# EAGLE design piboy (EAGLE 8.4.1)
COMPANY: ADAFRUIT INDUSTRIES; DRAWN: KTOWN; REV: A
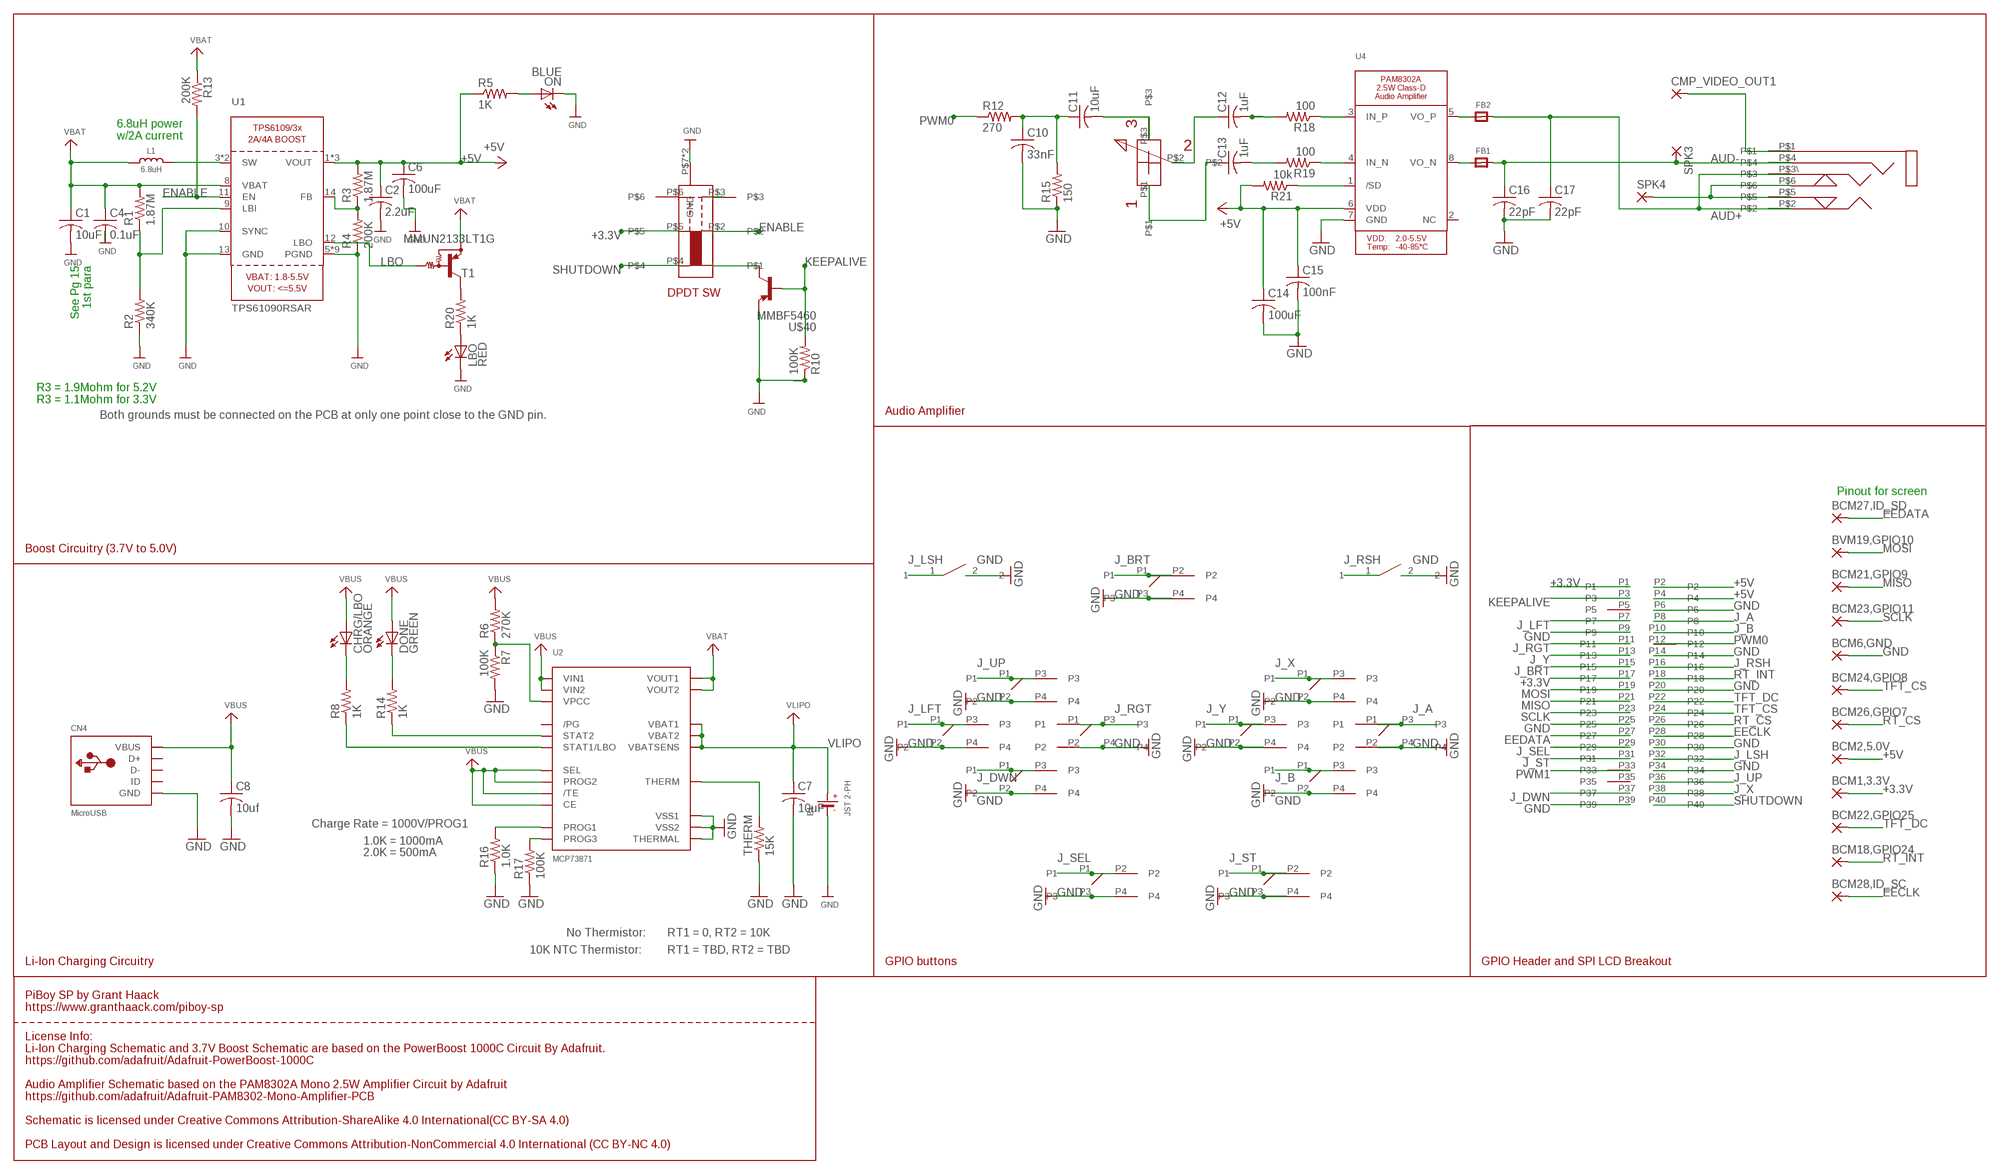
[diagram p0: schematic, sheet 1]

## Parts
B1  JST 2-PH  MICROBUILDER_BATTERYPH2_NOTHERMALS  [MICROBUILDER_JSTPH2_NOTHERMALS]
BCM1,3.3V  WIREPAD_1,6/0,9  [WIREPAD_1,6/0,9]
BCM2,5.0V  WIREPAD_1,6/0,9  [WIREPAD_1,6/0,9]
BCM6,GND  WIREPAD_1,6/0,9  [WIREPAD_1,6/0,9]
BCM18,GPIO24  WIREPAD_1,6/0,9  [WIREPAD_1,6/0,9]
BCM21,GPIO9  WIREPAD_1,6/0,9  [WIREPAD_1,6/0,9]
BCM22,GPIO25  WIREPAD_1,6/0,9  [WIREPAD_1,6/0,9]
BCM23,GPIO11  WIREPAD_1,6/0,9  [WIREPAD_1,6/0,9]
BCM24,GPIO8  WIREPAD_1,6/0,9  [WIREPAD_1,6/0,9]
BCM26,GPIO7  WIREPAD_1,6/0,9  [WIREPAD_1,6/0,9]
BCM27,ID_SD  WIREPAD_1,6/0,9  [WIREPAD_1,6/0,9]
BCM28,ID_SC  WIREPAD_1,6/0,9  [WIREPAD_1,6/0,9]
BVM19,GPIO10  WIREPAD_1,6/0,9  [WIREPAD_1,6/0,9]
C1  10uF  C-USC1210  [C1210]
C2  2.2uF  C-USC0805  [C0805]
C4  0.1uF  C-USC0805  [C0805]
C6  100uF  C-USC1210  [C1210]
C7  10uF  C-USC1210  [C1210]
C8  10uf  C-USC0805  [C0805]
C10  33nF  C-USC0805  [C0805]
C11  10uF  C-USC1210  [C1210]
C12  1uF  C-USC0805  [C0805]
C13  1uF  C-USC0805  [C0805]
C14  100uF  C-USC1210  [C1210]
C15  100nF  C-USC0805  [C0805]
C16  22pF  C-USC0805  [C0805]
C17  22pF  C-USC0805  [C0805]
CHRG/LBO  ORANGE  ADAFRUIT_LEDCHIPLED_0603  [ADAFRUIT_CHIPLED_0603]
CMP_VIDEO_OUT1  WIREPAD_1,6/0,9  [WIREPAD_1,6/0,9]
CN4  MicroUSB  USBMICRO_20329  [4UCONN_20329]
DONE  GREEN  ADAFRUIT_LEDCHIPLED_0603  [ADAFRUIT_CHIPLED_0603]
FB1  FERRITE0805  [0805]
FB2  FERRITE0805  [0805]
L1  6.8uH  INDUCTORTDK_VLC5045  [INDUCTOR_5X5MM_TDK_VLC5045]
LBO  RED  ADAFRUIT_LEDCHIPLED_0603  [ADAFRUIT_CHIPLED_0603]
ON  BLUE  ADAFRUIT_LEDCHIPLED_0603  [ADAFRUIT_CHIPLED_0603]
R1  1.87M  R-US_R0805  [R0805]
R2  340K  R-US_R0805  [R0805]
R3  1.87M  R-US_R0805  [R0805]
R4  200K  R-US_R0805  [R0805]
R5  1K  R-US_R0805  [R0805]
R6  270K  R-US_R0805  [R0805]
R7  100K  R-US_R0805  [R0805]
R8  1K  R-US_R0805  [R0805]
R10  100K  R-US_R0805  [R0805]
R12  270  R-US_R0805  [R0805]
R13  200K  R-US_R0805  [R0805]
R14  1K  R-US_R0805  [R0805]
R15  150  R-US_R0805  [R0805]
R16  1.0K  R-US_R0805  [R0805]
R17  100K  R-US_R0805  [R0805]
R18  100  R-US_R0805  [R0805]
R19  100  R-US_R0805  [R0805]
R20  1K  R-US_R0805  [R0805]
R21  10k  R-US_R0805  [R0805]
SPK3  WIREPAD_1,6/0,9  [WIREPAD_1,6/0,9]
SPK4  WIREPAD_1,6/0,9  [WIREPAD_1,6/0,9]
T1  MMUN2133LT1G  TRANSISTOR_MUN2113T1-PNP_DRIVER-SC59-BEC  [TRANSISTOR_SC59-BEC]
THERM  15K  R-US_R0805  [R0805]
U1  TPS61090RSAR  VREG_TPS6103X  [PVQFN-16]
U2  MCP73871  [QFN20_4MM]
U4  AUDIOAMP_PAM8302A  [MSOP8_0.65MM]
U$9  961240-6300-AR-PR  [961240-6300-AR-PR]
U$10  PIBOY_SKRRAAE010  [PIBOY_SKRRAAE010]
U$11  PIBOY_SKRRAAE010  [PIBOY_SKRRAAE010]
U$12  PIBOY_SKRRAAE010  [PIBOY_SKRRAAE010]
U$13  PIBOY_SKRRAAE010  [PIBOY_SKRRAAE010]
U$15  PIBOY_SKRRAAE010  [PIBOY_SKRRAAE010]
U$16  PIBOY_SKRRAAE010  [PIBOY_SKRRAAE010]
U$17  PIBOY_SKRRAAE010  [PIBOY_SKRRAAE010]
U$18  PIBOY_SKRRAAE010  [PIBOY_SKRRAAE010]
U$21  PIBOY_TL3315NF100Q  [PIBOY_TL3315NF100Q]
U$22  PIBOY_TL3315NF100Q  [PIBOY_TL3315NF100Q]
U$25  PIBOY_TL3315NF100Q  [PIBOY_TL3315NF100Q]
U$26  SWITCH_TL1105L-4,3  [SWITCH_TL1105L-4,3]
U$28  SWITCH_TL1105L-4,3  [SWITCH_TL1105L-4,3]
U$29  RK10J12R0A0B  [RK10J12R0A0B]
U$30  SJ-43504-SMT-TR  [SJ-43504-SMT-TR]
U$31  EG2210-SW  [EG2210-SW]
U$40  MMBF5460  [SOT23]

## Nets
+3.3V: BCM1,3.3V.1(P) U$9.P1 U$9.P17 U$31.P$5
+5V: BCM2,5.0V.1(P) C2.1 C6.1 C14.1 C15.1 R3.2 R5.1 R21.2 U1.1(VOUT) U1.15(VOUT) U1.16(VOUT) U4.6(VDD) U$9.P2 U$9.P4
AUD+: C17.1 FB2.2 U$30.P$2 U$30.P$3\
AUD+_HDPN_OUT: SPK4.1(P) U$30.P$5 U$30.P$6
AUD-: C16.1 FB1.2 SPK3.1(P) U$30.P$4
CMP_VIDEO_OUT1: CMP_VIDEO_OUT1.1(P) U$30.P$1
EECLK: BCM28,ID_SC.1(P) U$9.P28
EEDATA: BCM27,ID_SD.1(P) U$9.P27
ENABLE: R13.2 U1.11(EN) U$31.P$2
GND: B1.1(-) B1.NC1(-) B1.NC2(-) BCM6,GND.1(P) C1.2 C2.2 C4.2 C6.2 C7.2 C8.2 C10.2 C14.2 C15.2 C16.2 C17.2 CN4.BASE@1(GND) CN4.BASE@2(GND) CN4.GND CN4.SPRT@1(GND) CN4.SPRT@2(GND) CN4.SPRT@3(GND) CN4.SPRT@4(GND) LBO.C ON.C R2.1 R4.1 R7.2 R10.1 R15.1 R16.1 R17.1 THERM.1 U1.5(PGND) U1.6(PGND) U1.7(PGND) U1.10(SYNC) U1.13(GND) U1.P$18(PGND) U1.P$19(PGND) U1.P$20(PGND) U1.P$21(PGND) U1.P$22(PGND) U1.THERMAL(PGND) U2.P$10(VSS1) U2.P$11(VSS2) U2.P$21(THERMAL) U4.7(GND) U$9.P6 U$9.P9 U$9.P14 U$9.P20 U$9.P25 U$9.P30 U$9.P34 U$9.P39 U$10.P2 U$10.P4 U$11.P2 U$11.P4 U$12.P2 U$12.P4 U$13.P2 U$13.P4 U$15.P2 U$15.P4 U$16.P2 U$16.P4 U$17.P2 U$17.P4 U$18.P2 U$18.P4 U$21.P3 U$21.P4 U$22.P3 U$22.P4 U$25.P3 U$25.P4 U$26.2 U$28.2 U$31.P$7(GND) U$31.P$8(GND) U$40.2(S)
J_A: U$9.P8 U$17.P1 U$17.P3
J_B: U$9.P10 U$18.P1 U$18.P3
J_BRT: U$9.P15 U$25.P1 U$25.P2
J_DWN: U$9.P37 U$13.P1 U$13.P3
J_LFT: U$9.P7 U$11.P1 U$11.P3
J_LSH: U$9.P32 U$26.1
J_RGT: U$9.P11 U$12.P1 U$12.P3
J_RSH: U$9.P16 U$28.1
J_SEL: U$9.P29 U$21.P1 U$21.P2
J_ST: U$9.P31 U$22.P1 U$22.P2
J_UP: U$9.P36 U$10.P1 U$10.P3
J_X: U$9.P38 U$15.P1 U$15.P3
J_Y: U$9.P13 U$16.P1 U$16.P3
KEEPALIVE: R10.2 U$9.P3 U$40.3(G)
LBO: T1.B U1.12(LBO)
MISO: BCM21,GPIO9.1(P) U$9.P21
MOSI: BVM19,GPIO10.1(P) U$9.P19
N$1: L1.P$2 U1.3(SW) U1.4(SW)
N$2: LBO.A R20.1
N$3: R1.1 R2.2 U1.9(LBI)
N$4: ON.A R5.2
N$5: R3.1 R4.2 U1.14(FB)
N$6: R20.2 T1.C
N$7: R6.1 R7.1 U2.P$2(VPCC)
N$8: DONE.C R14.2
N$9: R14.1 U2.P$7(STAT2)
N$10: THERM.2 U2.P$5(THERM)
N$11: R8.1 U2.P$8(STAT1/LBO)
N$12: CHRG/LBO.C R8.2
N$13: R17.2 U2.P$12(PROG3)
N$16: R16.2 U2.P$13(PROG1)
N$18: C10.1 C11.1 R12.2 R15.2
N$20: U$31.P$3
N$21: U$31.P$1 U$40.1(D)
N$35: C11.2 U$29.P$3
N$37: C12.1 U$29.P$2
N$38: C13.1 U$29.P$1
N$39: C13.2 R19.2
N$40: C12.2 R18.2
N$41: R18.1 U4.3(IN_P)
N$42: R19.1 U4.4(IN_N)
N$45: R21.1 U4.1(/SD)
N$47: FB1.1 U4.8(VO_N)
N$48: FB2.1 U4.5(VO_P)
PWM0: R12.1 U$9.P12
PWM1: U$9.P33
RT_CS: BCM26,GPIO7.1(P) U$9.P26
RT_INT: BCM18,GPIO24.1(P) U$9.P18
SCLK: BCM23,GPIO11.1(P) U$9.P23
SHUTDOWN: U$9.P40 U$31.P$4
TFT_CS: BCM24,GPIO8.1(P) U$9.P24
TFT_DC: BCM22,GPIO25.1(P) U$9.P22
VBAT: C1.1 C4.1 L1.P$1 R1.2 R13.1 T1.E U1.8(VBAT) U2.P$1(VOUT1) U2.P$20(VOUT2)
VBUS: C8.1 CHRG/LBO.A CN4.VBUS DONE.A R6.2 U2.P$3(SEL) U2.P$4(PROG2) U2.P$9(/TE) U2.P$17(CE) U2.P$18(VIN1) U2.P$19(VIN2)
VLIPO: B1.2(+) C7.1 U2.P$14(VBAT1) U2.P$15(VBAT2) U2.P$16(VBATSENS)
Unconnected: CN4.D+ CN4.D- CN4.ID U2.P$6(/PG) U4.2(NC) U$9.P5 U$9.P35 U$31.P$6

## Notes on the sheet
- 6.8uH power
  w/2A current
- See Pg 15
  1st para
- R3 = 1.9Mohm for 5.2V
  R3 = 1.1Mohm for 3.3V
- Both grounds must be connected on the PCB at only one point close to the GND pin. | Audio Amplifier
- Pinout for screen
- Boost Circuitry (3.7V to 5.0V)
- Charge Rate = 1000V/PROG1
- 1.0K = 1000mA
- 2.0K = 500mA
- No Thermistor: | RT1 = 0, RT2 = 10K
- 10K NTC Thermistor: | RT1 = TBD, RT2 = TBD
- Li-Ion Charging Circuitry | GPIO buttons | GPIO Header and SPI LCD Breakout
- PiBoy SP by Grant Haack
  https://www.granthaack.com/piboy-sp
- License Info:
  Li-Ion Charging Schematic and 3.7V Boost Schematic are based on the PowerBoost 1000C Circuit By Adafruit.
  https://github.com/adafruit/Adafruit-PowerBoost-1000C
  
  Audio Amplifier Schematic based on the PAM8302A Mono 2.5W Amplifier Circuit by Adafruit
  https://github.com/adafruit/Adafruit-PAM8302-Mono-Amplifier-PCB
  
  Schematic is licensed under Creative Commons Attribution-ShareAlike 4.0 International(CC BY-SA 4.0)
  
  PCB Layout and Design is licensed under Creative Commons Attribution-NonCommercial 4.0 International (CC BY-NC 4.0)

## Library data of the parts
B1 = piboy_new:MICROBUILDER_BATTERY: CR1220 SMT - Digikey: 3001K-ND CD2032 BAT-HLD-001 - Digikey: BAT-HLD-001-ND
BCM1,3.3V BCM2,5.0V BCM6,GND BCM18,GPIO24 BCM21,GPIO9 BCM22,GPIO25 BCM23,GPIO11 BCM24,GPIO8 BCM26,GPIO7 BCM27,ID_SD BCM28,ID_SC BVM19,GPIO10 CMP_VIDEO_OUT1 SPK3 SPK4 = piboy_new:WIREPAD_1,6/0,9: THROUGH-HOLE PAD
C1 C6 C7 C10-C17 = resistor:C-US: CAPACITOR, American symbol
C2 C4 C8 = adafruit:C-US: CAPACITOR, American symbol
CHRG/LBO DONE LBO ON = piboy_new:ADAFRUIT_LED: LED OSRAM: - CHIPLED LG R971, LG N971, LY N971, LG Q971, LY Q971, LO R971, LY R971 LH N974, LH R974 LS Q976, LO Q976, LY Q976 LO Q996 - Hyper CHIPLED LW Q18S LB Q993, LB Q99A, LB R99A - SideLED LS A670, LO A670, LY A670, LG A670, LP A670 LB A673, LV A673, LT A673, LW A673 LH A674 LY A675 LS A676, LA A676, LO A676, LY A676, LW A676 LS A679, LY A679, LG A679 - Hyper Micro SIDELED® LS Y876, LA Y876, LO Y876, LY Y876 LT Y87S - SmartLED LW L88C, LW L88S LB L89C, LB L89S, LG L890 LS L89K, LO L89K, LY L89K LS L896, LA L896, LO L896, LY L896 - TOPLED LS T670, LO T670, LY T670, LG T670, LP T670 LSG T670, LSP T670, LSY T670, LOP T670, LYG T670 LG T671, LOG T671, LSG T671 LB T673, LV T673, LT T673, LW T673 LH T674 LS T676, LA T676, LO T676, LY T676, LB T676, LH T676, LSB T676, LW T676 LB T67C, LV T67C, LT T67C, LS T67K, LO T67K, LY T67K, LW E67C LS E67B, LA E67B, LO E67B, LY E67B, LB E67C, LV E67C, LT E67C LW T67C LS T679, LY T679, LG T679 LS T770, LO T770, LY T770, LG T770, LP T770 LB T773, LV T773, LT T773, LW T773 LH T774 LS E675, LA E675, LY E675, LS T675 LS T776, LA T776, LO T776, LY T776, LB T776 LHGB T686 LT T68C, LB T68C - Hyper Mini TOPLED® LB M676 - Mini TOPLED Santana® LG M470 LS M47K, LO M47K, LY M47K Source: http://www.osram.convergy.de/
CN4 = microbuilder:USB: USB Connectors USBMINIB - Surface Mount Female Mini-B USB Connector 4UConnector: 06564
FB1 FB2 = Adafruit PAM8302:FERRITE: Ferrite Bead 0603 MMZ1608B121C - 120 Ohm @ 100MHz, 600mA, 0.15 Ohm DC Resistance - Digikey: 445-2164-1-ND BK1608HW121-T - 120 Ohm, 600mA Ferrite Chip - Digikey: 587-1876-2-ND 0805 HZ0805B272R-10 - 2.7K Ohm @ 100MHz, 200mA, 0.8 Ohm DC Resistance - Digikey: 240-2504-1-ND (see also Murata BLM21BD272SN1L) MMZ2012Y152B - 1.5K Ohm @ 100MHz, 500mA, 0.4 Ohm DC Resistance - Digikey: 445-1560-1-ND - Mainly for high frequency (80-400MHz) MMZ2012R102A - 1K Ohm @ 100MHz, 500mA, 0.3 Ohm DC Resistance - Digikey: 445-1555-2-ND - More general purpose (10-200MHz)
L1 = microbuilder:INDUCTOR: Inductors 0603: 10nH Ceramic Inductor - microwire antenna/RF (Digikey: 712-1434-2-ND) 0805: 560nH Ceramic Inductor - RF (Digikey: 553-1047-1-ND) 270nH Ceramic Inductor - Q = 40@250MHz, +-5%, 1 Ohm DC Resistance (Digikey: 535-10506-2-ND) 1007 (2518 Metric) SMT: 10µH 10% 250mOhm 820mA 1007 Inductor (Digikey: 587-2189-1-ND) 22µH 10% 500mOhm 580mA 1007 Inductor (Digikey: 587-2190-1-ND) 47µH 10% 950mOhm 420mA 1007 Inductor (Digikey: 587-2191-1-ND) 47µH 5% 100mOhm 1A 1008 Inductor (Digikey: 732-1816-1-ND) 5.0x5.0mm (Taiyo Yuden NR5040 Series) 6.8µH 20% 2.3A 64mOhm Inductor (Digikey: 587-2374-2-ND) 5.0x5.0mm (TDK VLC5045 Series) 4.7µH 20% 3.3A 34mOhm Inductor (Digikey: 445-6526-1-ND) 6.8µH 20% 2.7A 46mOhm Inductor (Digikey: 445-6527-1-ND) 6.0x6.0mm (TDK VLC6045 Series) 4.7µH 20% 3.8A 27mOhm Inductor (Digikey: 445-6538-2-ND) 6.8µH 20% 3A 41mOhm Inductor (Digikey: 445-6540-1-ND) 6.2µH 30% 2.2A 45mOhm Inductor (Digikey: SRR5028-6R2YCT-ND) - Not TDK VLC6045 but footprint should match 6.0x6.0mm (TDK SLF6045 Series) 6.8uH 30% 2A 33mOhm Inductor (Digikey: 445-4572-1-ND, Mouser: 810-SLF645T6R8N2R0PF) 6.0x6.0mm (Sumida CDRH5D28 Series) 6.2uH 30% 1.8A 45mOhm Inductor (Digikey: 308-1542-1-ND) Taiyo Yuden NR3015T2R2M - 2.2uH 20% 1.5A (Digikey: 587-1648-2-ND, Mouser: 963-NR3015T2R2M) - Used with TI TPS62172 CoilCraft RFID Transponder Coil - MA5532-AE (For use with AS3935 Lightning Sensor) Vishay IHLP 1.0uH Molded Inductor - 24mOhm DCR, 5A, +/-20%, -55°C-125°C (Digikey: 541-1319-1-ND)
R1-R8 R10 R13 R14 R16 R17 R20 THERM = adafruit:R-US_: RESISTOR, American symbol
R12 R15 R18 R19 R21 = resistor:R-US_: RESISTOR, American symbol
T1 = piboy_new:TRANSISTOR_*-PNP_DRIVER-: PNP Bias Resistor Transistor
U1 = microbuilder:VREG_TPS6103X: TPS6103x 4A Boost - 1.8-5.5V Input, Adjustable Output to 5.5V
U2 = microbuilder:MCP73871: MCP73871 Lithium Polymer Battery Charger Digikey: MCP73871-2CCI/ML-ND
U4 = Adafruit PAM8302:AUDIOAMP_PAM8302A: PAM8302A - 2.5W Class-D Mono Audio Amplifier MSOP8 = PAM8302AASCR
U$9 = piboy:961240-6300-AR-PR
U$10-U$13 U$15-U$18 = piboy_new:PIBOY_SKRRAAE010
U$21 U$22 U$25 = piboy_new:PIBOY_TL3315NF100Q
U$26 U$28 = piboy_new:SWITCH_TL1105L-4,3
U$29 = piboy_new:RK10J12R0A0B
U$30 =  SJ-43504-SMT-TR:SJ-43504-SMT-TR: SMT Audio Jack -mid mount for low profile applications -shielded -two internal switches, tip and ring
U$31 = piboy_new:EG2210-SW
U$40 = piboy_new:MMBF5460

## Board
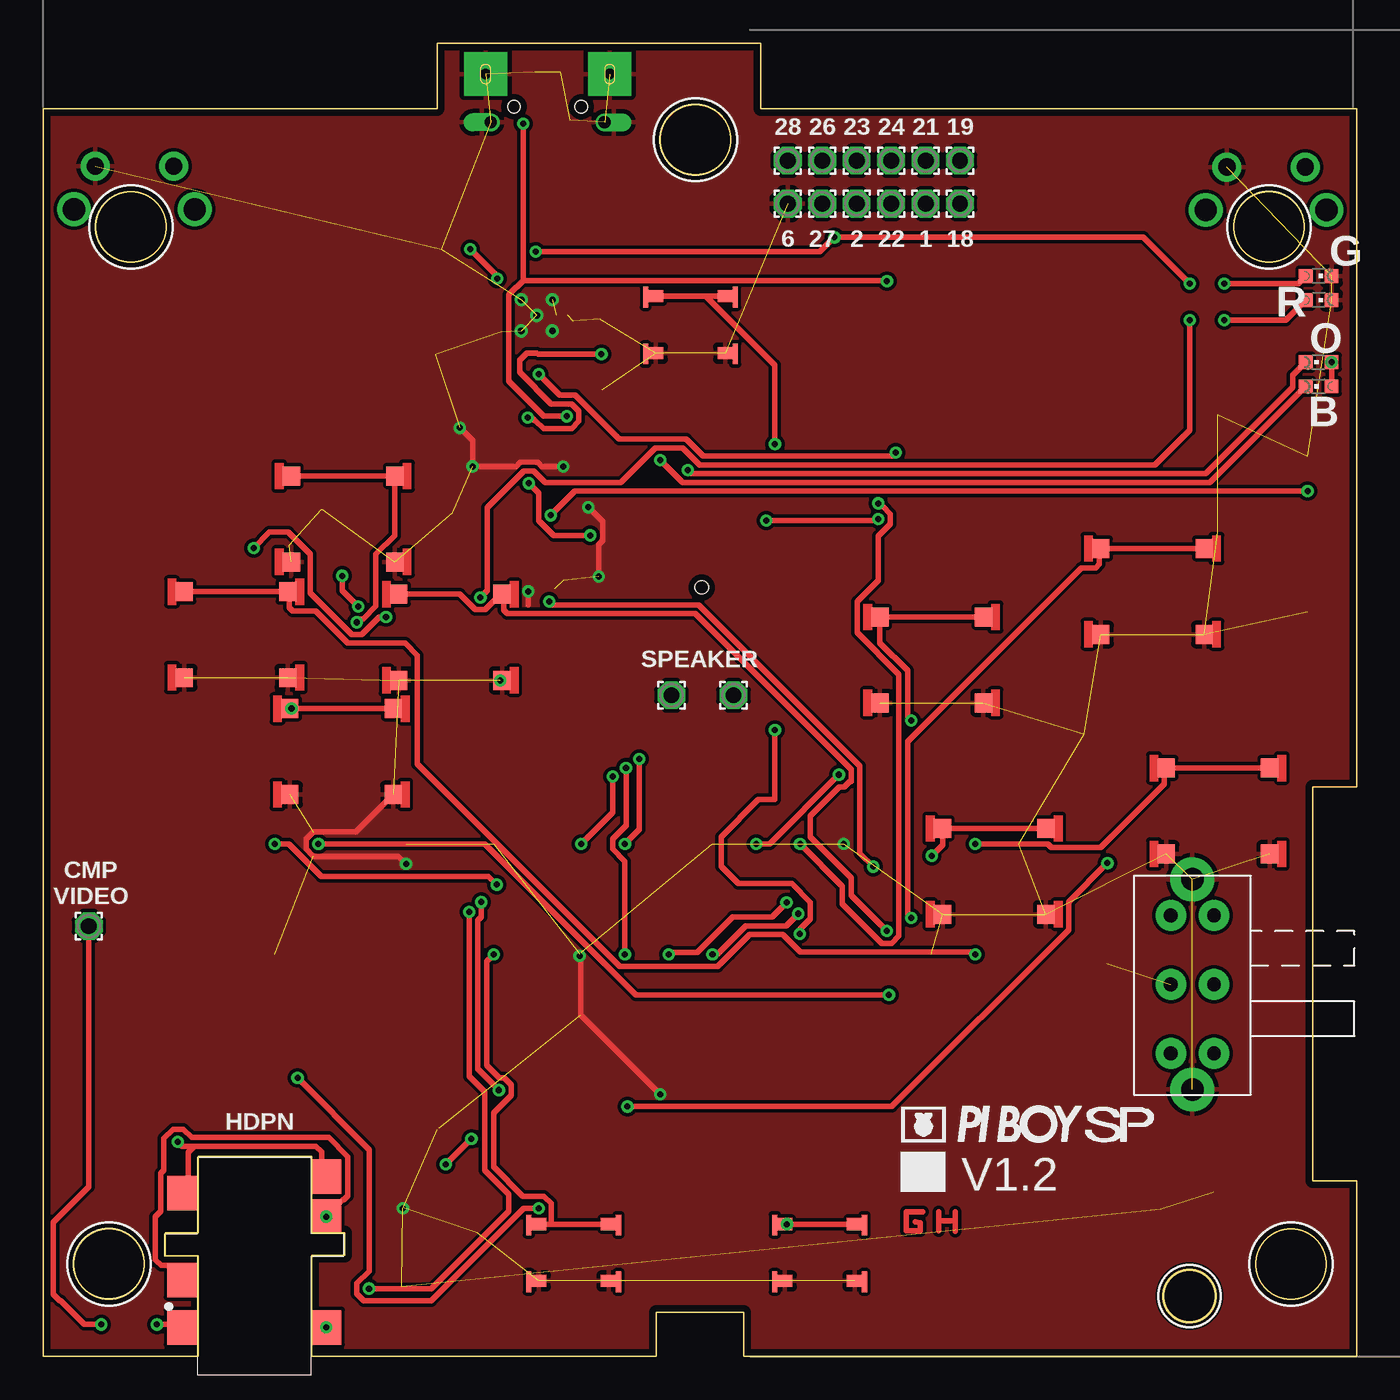
[diagram p1: board, top side]
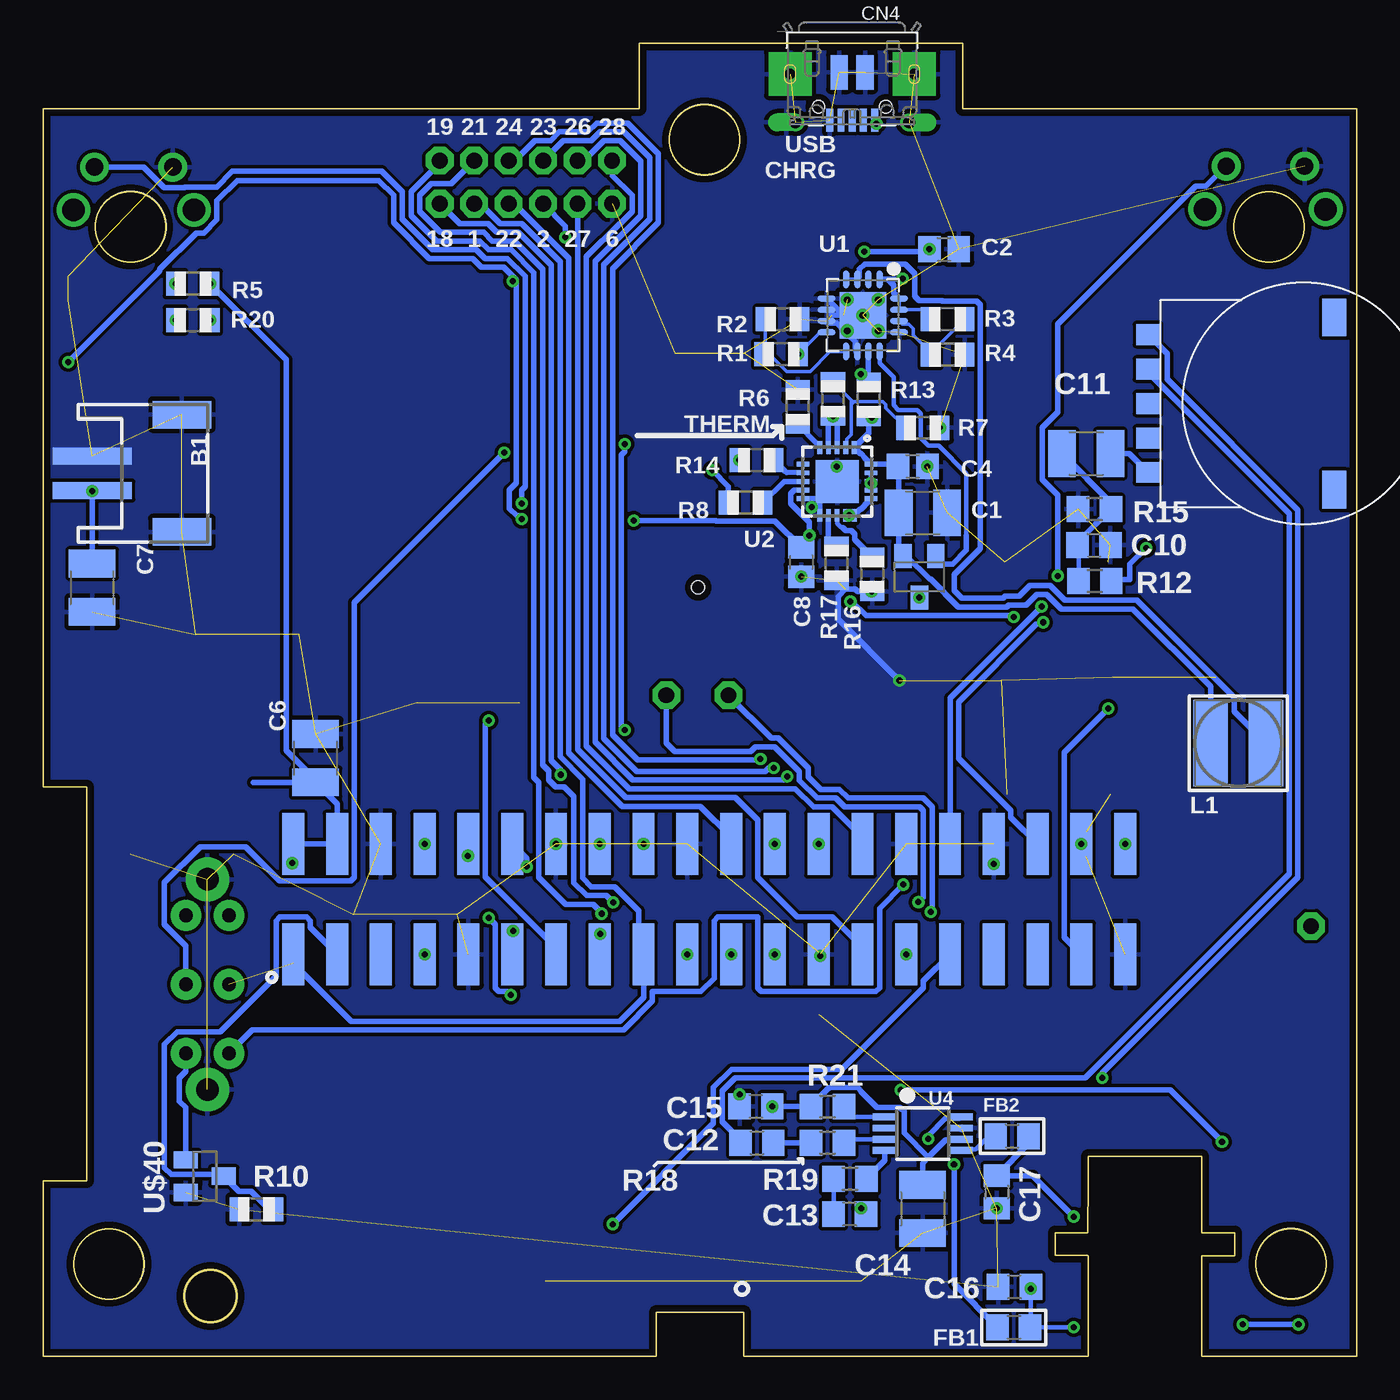
[diagram p2: board, bottom side, seen from below]

Size 76.21 x 76.22 mm. Coordinates in mm from the lower left corner, seen from the top.
Outline: 0.01,0.02 0.01,72.41 22.87,72.41 22.87,76.22 41.62,76.22 41.62,72.41 76.21,72.41 76.21,33.04 73.67,33.04 73.67,10.18 76.21,10.18 76.21,0.02 40.65,0.02 40.65,2.56 35.57,2.56 35.57,0.02
Outline: 8.99,0.02 8.99,5.85 7.09,5.85 7.09,7.18 8.99,7.18 8.99,11.61
Outline: 9,11.62 15.59,11.62 15.59,10.21 15.6,7.18 17.49,7.18 17.49,5.86 15.6,5.86
Outline: 15.59,5.85 15.59,0.03
Outline: 0,0 8.99,0
Outline: 15.59,0 35.56,0
Outline: circle at 72.4,5.35 radius 2.03
Outline: circle at 3.82,5.35 radius 2.03
Outline: circle at 37.85,70.61 radius 2.03
Outline: circle at 71.13,65.55 radius 2.03
Outline: circle at 5.09,65.55 radius 2.03
Outline: circle at 66.5,3.5 radius 1.5
Copper layers (1*16): Top 0.0356mm / dielectric 1.5011mm / Bottom 0.0356mm
Design rules "oshpark-2layer *": minimum track width 8mil, minimum drill 13mil, track to track 8mil, track to pad 8mil, pad to pad 8mil, via to via 8mil, smd to smd 0mil, copper to edge 15mil, drill to drill 8mil, minimum pad ring 7mil, minimum via ring 7mil, stop-mask expansion 2.5mil, vias tented up to drill 0mil, thermal gap 10mil
Holes 0.75 mm at 38.21,44.63
Holes 4.06 mm at 3.81,5.38 72.39,5.36 71.12,65.56 37.83,70.61 5.09,65.54
Holes 3.02 mm at 66.5,3.49

### Footprints (pad centres in the part's own frame; a part is rotated, then mirrored left to right if it is on the bottom)
MICROBUILDER_JSTPH2_NOTHERMALS = smd 1 x 4.6: 1 -1,-3.7; 2 1,-3.7 | smd 1.6 x 3.4: NC1 -3.4,1.5; NC2 3.4,1.5
WIREPAD_1,6/0,9 = drill 0.914 pad 1.6 octagon: 1 0,0
C1210 = smd 1.6 x 2.7: 1 -1.4,0; 2 1.4,0
C0805 = smd 1.3 x 1.5: 1 -0.85,0; 2 0.85,0
C0805' = smd 1.3 x 1.5: 1 -0.95,0; 2 0.95,0
ADAFRUIT_CHIPLED_0603 = smd 0.8 x 0.8: A 0,-0.75; C 0,0.75
4UCONN_20329 = smd 1 x 2: BASE@1 -0.75,-2; BASE@2 0.75,-2 | smd 0.4 x 1.35: D+ 0,0.775; D- -0.65,0.775; GND 1.3,0.775; ID 0.65,0.775; VBUS -1.3,0.775 | drill 0.7 offset: SPRT@1 -3.3,0.9; SPRT@2 3.3,0.9 | drill 0.6 pad 2.5 square: SPRT@3 -3.6,-1.9; SPRT@4 3.6,-1.9 | hole 0.7: -1.95,0; 1.95,0
0805 = smd 1.3 x 1.5: 1 -0.95,0; 2 0.95,0
INDUCTOR_5X5MM_TDK_VLC5045 = smd 2 x 5: P$1 -1.6,0; P$2 1.6,0
R0805 = smd 1.1 x 1.4: 1 -1,0; 2 1,0
R0805' = smd 1.3 x 1.5: 1 -0.95,0; 2 0.95,0
TRANSISTOR_SC59-BEC = smd 1 x 1.4: B -0.95,-1.2; C 0,1.2; E 0.95,-1.2
PVQFN-16 = smd 1.05 x 0.35: 1 -2.1,0.975; 2 -2.1,0.325; 3 -2.1,-0.325; 4 -2.1,-0.975; 9 2.1,-0.975; 10 2.1,-0.325; 11 2.1,0.325; 12 2.1,0.975 | smd 0.35 x 1.05: 5 -0.975,-2.1; 6 -0.325,-2.1; 7 0.325,-2.1; 8 0.975,-2.1; 13 0.975,2.1; 14 0.325,2.1; 15 -0.325,2.1; 16 -0.975,2.1 | drill 0.4: P$18 0,0; P$19 -0.9,0.9; P$20 0.9,0.9; P$21 0.9,-0.9; P$22 -0.9,-0.9 | smd 2.7 x 2.7: THERMAL 0,0
QFN20_4MM = smd 0.73 x 0.28: P$1 -1.965,1; P$2 -1.965,0.5; P$3 -1.965,0; P$4 -1.965,-0.5; P$5 -1.965,-1; P$11 1.965,-1; P$12 1.965,-0.5; P$13 1.965,0; P$14 1.965,0.5; P$15 1.965,1 | smd 0.28 x 0.73: P$6 -1,-1.965; P$7 -0.5,-1.965; P$8 0,-1.965; P$9 0.5,-1.965; P$10 1,-1.965; P$16 1,1.965; P$17 0.5,1.965; P$18 0,1.965; P$19 -0.5,1.965; P$20 -1,1.965 | smd 2.5 x 2.5: P$21 0,0
MSOP8_0.65MM = smd 0.4 x 1.4: 1 -0.975,-2.2; 2 -0.325,-2.2; 3 0.325,-2.2; 4 0.975,-2.2; 5 0.975,2.2; 6 0.325,2.2; 7 -0.325,2.2; 8 -0.975,2.2
961240-6300-AR-PR = smd 1.27 x 3.6: P1 -24.13,-3.2; P2 -24.13,3.2; P3 -21.59,-3.2; P4 -21.59,3.2; P5 -19.05,-3.2; P6 -19.05,3.2; P7 -16.51,-3.2; P8 -16.51,3.2; P9 -13.97,-3.2; P10 -13.97,3.2; P11 -11.43,-3.2; P12 -11.43,3.2; P13 -8.89,-3.2; P14 -8.89,3.2; P15 -6.35,-3.2; P16 -6.35,3.2; P17 -3.81,-3.2; P18 -3.81,3.2; P19 -1.27,-3.2; P20 -1.27,3.2; P21 1.27,-3.2; P22 1.27,3.2; P23 3.81,-3.2; P24 3.81,3.2; P25 6.35,-3.2; P26 6.35,3.2; P27 8.89,-3.2; P28 8.89,3.2; P29 11.43,-3.2; P30 11.43,3.2; P31 13.97,-3.2; P32 13.97,3.2; P33 16.51,-3.2; P34 16.51,3.2; P35 19.05,-3.2; P36 19.05,3.2; P37 21.59,-3.2; P38 21.59,3.2; P39 24.13,-3.2; P40 24.13,3.2
PIBOY_SKRRAAE010 = smd 1 x 1.1: P1 -3,2.5; P2 -3,-2.5; P3 3,2.5; P4 3,-2.5
PIBOY_TL3315NF100Q = smd 0.9 x 0.7: P1 -2.025,1.65; P2 2.025,1.65; P3 -2.025,-1.65; P4 2.025,-1.65 | smd 0.3 x 1.2: P$1 -2.6,1.6; P$2 2.6,1.6; P$3 -2.6,-1.7; P$4 2.6,-1.7
SWITCH_TL1105L-4,3 = drill 1 pad 1.676: 1 -2.275,0; 2 2.275,0 | drill 1.3 pad 1.9: 3 -3.5,2.5; 4 3.5,2.5
RK10J12R0A0B = smd 2.2 x 1.4: GND1 -5,1.8; GND2 5,1.8 | smd 1.2 x 1.4: P$1 -4,-9; P$2 -2,-9; P$2-2 0,-9; P$3 4,-9; P$3-2 2,-9
SJ-43504-SMT-TR = smd 2 x 1.75: P$1 2.75,7.48; P$2 9.18,-0.88; P$3\ 5.5,7.48; P$4 2.75,-0.88; P$5 11.5,-0.88; P$6 10.55,7.48
EG2210-SW = drill 0.8 pad 1.778: P$1 -4,-1.25; P$2 0,-1.25; P$3 4,-1.25; P$4 -4,1.25; P$5 0,1.25; P$6 4,1.25 | drill 1.3 pad 2.54: P$7 6.1,0; P$8 -6.1,0
SOT23 = smd 1 x 1.4: 1 -0.95,-1.1; 2 0.95,-1.1; 3 0,1.1

### Placement (x,y rotation side)
B1  69.66,51.25 270 bottom
BCM1,3.3V  51.2,66.9 0 top
BCM2,5.0V  47.2,66.9 0 top
BCM6,GND  43.2,66.9 0 top
BCM18,GPIO24  53.2,66.9 0 top
BCM21,GPIO9  51.2,69.4 0 top
BCM22,GPIO25  49.2,66.9 0 top
BCM23,GPIO11  47.2,69.4 0 top
BCM24,GPIO8  49.2,69.4 0 top
BCM26,GPIO7  45.2,69.4 0 top
BCM27,ID_SD  45.2,66.9 0 top
BCM28,ID_SC  43.2,69.4 0 top
BVM19,GPIO10  53.2,69.4 0 top
C1  25.17,48.96 0 bottom
C2  23.94,64.25 0 bottom
C4  25.76,51.65 0 bottom
C6  60.4,34.72 90 bottom
C7  73.37,44.61 270 bottom
C8  32.23,46.1 270 bottom
C10  33nF  [C0805']  15.24,47.08 0 bottom
C11  15.7,52.4 0 bottom
C12  1uF  [C0805']  34.8,12.4 0 bottom
C13  1uF  [C0805']  29.41,8.26 180 bottom
C14  25.19,8.56 270 bottom
C15  100nF  [C0805']  34.86,14.51 180 bottom
C16  22pF  [C0805']  19.86,4.03 180 bottom
C17  22pF  [C0805']  20.88,9.54 270 bottom
CHRG/LBO  74,57.7 90 top
CMP_VIDEO_OUT1  2.65,24.97 0 top
CN4  29.27,72.53 180 bottom
DONE  74,56.3 90 top
FB1  19.89,1.69 0 bottom
FB2  19.99,12.78 0 bottom
L1  6.87,35.59 0 bottom
LBO  74,61.3 270 top
ON  74,62.7 270 top
R1  33.39,58.17 0 bottom
R2  33.3,60.19 180 bottom
R3  23.75,60.2 180 bottom
R4  23.74,58.14 180 bottom
R5  67.53,62.26 180 bottom
R6  30.38,55.56 270 bottom
R7  25.18,53.89 0 bottom
R8  35.46,49.55 180 bottom
R10  63.83,8.53 0 bottom
R12  270  [R0805']  15.19,44.99 180 bottom
R13  28.31,55.55 90 bottom
R14  34.81,52.01 180 bottom
R15  150  [R0805']  15.21,49.17 0 bottom
R16  28.12,45.4 90 bottom
R17  30.18,46.03 90 bottom
R18  100  [R0805']  30.7,12.4 180 bottom
R19  100  [R0805']  29.4,10.3 180 bottom
R20  67.52,60.14 0 bottom
R21  10k  [R0805']  30.7,14.5 180 bottom
SPK3  36.45,38.37 0 top
SPK4  40.05,38.37 0 top
T1  25.37,45.25 180 bottom
THERM  32.44,55.1 270 bottom
U1  28.65,60.42 270 bottom
U2  30.15,50.78 270 bottom
U4  25.17,12.93 270 bottom
U$9  37.56,26.54 0 bottom
U$10  17.41,48.6 0 top
U$11  11.19,41.89 0 top
U$12  23.63,41.74 0 top
U$13  17.31,35.1 0 top
U$15  64.36,44.4 0 top
U$16  51.55,40.42 0 top
U$17  68.15,31.65 0 top
U$18  55.18,28.15 0 top
U$21  30.78,6.03 0 top
U$22  45.05,6.03 0 top
U$25  37.55,59.88 0 top
U$26  5.3,69.08 180 top
U$28  70.95,69.03 180 top
U$29  3.1,55.3 270 bottom
U$30  15.54,-1.07 90 top
U$31  66.67,21.59 90 top
U$40  66.83,10.46 270 bottom

### Tracks (layer width: path | path; a pad name or v marks a point on that pad's centre or on a via)
+3.3V  (1 unrouted)
  Bottom 0.305: U$9.P17 41.82,23.79 41.82,24.71 | BCM1,3.3V.1 50.83,66.9 49.68,65.74 48.43,65.74 46.22,63.53 46.22,34.8 44.91,33.49 44.91,27.76 44.4,27.25 43.04,27.25 41.66,25.87 41.66,23.62 U$9.P17 | U$9.P17 41.38,20.83 42.75,19.46 58.34,19.46 61.7,22.81 U$9.P1
+5V  (via drill 0.35)
  Top 0.305: v26.35,62.55 26.35,62.69 C2.1 | R5.1 63.84,64.94 v45.91,64.94 45.07,64.11 v28.57,64.11 | v61.75,28.63 59.5,26.38 59.5,24.76 49.24,14.5 v33.9,14.5
  Bottom 0.203: U1.16 U1.15 25.29,60.74 R3.2
  Bottom 0.305: U4.6 23.02,12.56 23.84,12.56 24.85,11.55 | 24.85,11.55 25.18,11.21 C14.1 | 24.85,11.55 26.27,12.96 26.27,14.27 26.33,14.34 26.4,14.34 26.52,14.46 27.84,14.46 28.74,15.37 28.74,15.4 28.95,15.61 30.55,15.61 30.56,15.59 30.63,15.59 31.65,14.57 R21.2 v33.9,14.5 C15.1 | U1.16 26.87,61.71 26.87,62.18 27.21,62.52 U1.1 26.38,62.52 v26.35,62.55 | BCM2,5.0V.1 45.91,65.61 v45.91,64.94 | v28.57,64.11 24.93,64.11 C2.1 | C6.1 59.16,32.07 U$9.P4 61.67,29.74 | 61.67,29.74 U$9.P2 | v61.75,28.63 61.67,28.7 61.67,29.74 | C6.1 60.4,33.47 62.11,35.17 62.11,57.84 R5.1 | 64.03,33.32 C6.1
  other vias: 24.79,64.25 66.53,62.26
AUD+  (via drill 0.35)
  Top 0.305: U$30.P$3\ 7.22,5.28 6.85,5.28 6.52,5.62 6.52,8.09 6.83,8.41 6.83,10.63 7.01,10.81 7.01,12.65 7.54,13.18 8.13,13.18 8.61,12.7 16.57,12.7 17.68,11.59 17.68,9.31 17.45,9.08 17.39,9.08 U$30.P$2
  Bottom 0.305: FB2.2 19.04,12.33 C17.1 18.8,10.49 U$30.P$2
  other vias: 16.42,8.11
AUD+_HDPN_OUT  (via drill 0.35)
  Top 0.254: 8.44,11.84 8.44,9.86 U$30.P$6
  Top 0.305: U$30.P$6 8.42,9.84 | 8.76,12.19 15.83,12.19 16.16,11.86 16.16,10.7 U$30.P$5 | 8.42,11.85 8.76,12.19 | 8.42,10.16 8.42,11.85 | v7.82,12.45 8.07,12.19 8.76,12.19 | 8.44,11.84 8.43,11.85 8.42,11.85 | v25.43,26.36 25.43,25.5 25.23,25.3 25.23,16.68 v26.45,15.46
  Bottom 0.305: SPK4.1 40.05,35.59 39.57,35.11 35.16,35.11 34.89,35.38 33.76,35.38 32.33,33.95 32.33,33.43 31.3,32.4 30.22,32.4 29.71,31.89 25.35,31.89 25.14,31.68 25.14,26.65 v25.43,26.36 | v7.82,12.45 10.82,15.46 v26.45,15.46
AUD-  (via drill 0.35)
  Top 0.305: v24.72,25.79 24.72,16.26 25.63,15.35 25.63,10.79 27.01,9.41 27.01,8.43 22.51,3.94 v18.91,3.94
  Bottom 0.254: U$30.P$4 FB1.2 18.91,1.72 v18.91,3.94 C16.1
  Bottom 0.305: 24.59,29.67 24.64,29.72 24.64,30.73 | 24.64,30.73 24.64,31.9 25.14,32.4 29.5,32.4 30.01,32.91 31.09,32.91 31.82,33.64 31.82,34.16 33.55,35.88 33.97,35.88 SPK3.1 | 24.64,30.73 24.64,25.87 v24.72,25.79
  other vias: 16.42,1.68
CMP_VIDEO_OUT1  (via drill 0.35)
  Top 0.305: v3.38,1.85 2.39,1.85 1.02,3.23 0.96,3.23 0.58,3.61 0.58,7.79 2.64,9.86 CMP_VIDEO_OUT1.1 | U$30.P$1 7.89,1.85 v6.6,1.85
  Bottom 0.305: v3.38,1.85 v6.6,1.85
EECLK
  Bottom 0.305: BCM28,ID_SC.1 43.2,68.53 42.04,67.38 42.04,66.42 42.72,65.74 42.76,65.74 44.69,63.82 44.69,35.44 42.2,32.94 32.56,32.94 31.51,31.89 30.43,31.89 28.77,30.23 28.68,30.23 U$9.P28
EEDATA
  Bottom 0.305: BCM27,ID_SD.1 45.2,35.23 42.41,32.44 36.05,32.44 34.75,31.13 34.75,27.79 32.45,25.49 30.43,25.49 29.07,24.13 28.68,24.13 U$9.P27
ENABLE  (via drill 0.35)
  Top 0.305: 28.68,56.8 28.76,56.88 v28.76,57 29.99,55.78 30.89,55.78 33.43,53.23 37.32,53.23 38.3,52.25 49.26,52.25 v49.46,52.45
  Bottom 0.305: 28.58,56.82 R13.2 | U1.11 28.33,56.56 R13.2 | R13.2 v28.76,57 | U$31.P$2 67.92,23.83 69.17,25.07 69.17,27.49 67.1,29.56 64.46,29.56 62.48,27.58 58.37,27.58 58.16,27.79 58.16,43.75 v49.46,52.45
GND  (via drill 0.35)  (68 unrouted)
  Top 0.305: v35.81,15.21 31.19,19.82 31.19,23.42 | 31.19,23.42 31.21,23.44 | 31.19,23.42 31.12,23.35 v31.12,23.25 | C17.2 20.88,8.61 20.9,8.64 | U$13.P4 18.15,30.45 15.68,30.45 15.27,30.03 15.27,29.45 15.68,29.03 20.6,29.03 v21.06,28.57 | v31.62,49.28 32.46,48.44 32.46,47.36 32.23,47.13 32.23,45.34 32.28,45.34 32.28,45.3 C8.2 | v28.15,44.4 28.15,43.62 | U$12.P4 v26.53,39.24 | R7.2 24.91,53.16 C4.2 27.45,51.66 27.68,51.89 28.69,51.89 28.94,51.64 v30.18,51.64
  Bottom 0.203: 31.02,49.91 U2.P$21
  Bottom 0.305: U2.P$11 31.15,49.3 | 31.15,49.3 31.15,49.78 | U2.P$10 31.15,49.78 | 31.15,49.78 31.02,49.91 | C15.2 v35.81,15.21 | v31.12,23.25 U$9.P25 | 22.88,13.16 U4.7 | v21.06,28.57 U$9.P34 | 31.15,49.3 31.6,49.3 v31.62,49.28 | v28.15,44.4 R16.1 28.96,44.4 29.08,44.52 29.67,44.52 30.08,44.11 30.08,42.79 v26.53,39.24 | U2.P$21 30.15,51.61 v30.18,51.64 | U1.10 29.09,58.44 29.09,58.89 29.55,59.34 U1.P$21 29.73,59.52 30.18,59.97 30.63,59.97 U1.7 | U1.6 30.43,60.42 U1.THERMAL 29.78,60.42 U1.5
  other vias: 20.88,8.59 32.23,45.25 24.18,53.89 24.91,51.65 46.45,29.74
  pour Bottom: 0,0 0,72.5 23,72.5 23,76 41.5,76 41.5,72.5 76,72.5 76,33 73.5,33 73.5,10 76,10 76,0 41,0 41,2.5 35.5,2.5 35.5,0 15.5,0 15.5,11.5 9,11.5 9,0
  pour Top: 0,0 0,72.5 23,72.5 23,76 41.5,76 41.5,72.5 76,72.5 76,33 73.5,33 73.5,10 76,10 76,0 41,0 41,2.5 35.5,2.5 35.5,0 15.5,0 15.5,11.5 9,11.5 9,0
J_A  (via drill 0.35)
  Top 0.305: U$17.P3 U$17.P1 65.06,34.05 65.06,33.23 61.35,29.53 58.49,29.53 58.27,29.74 U$9.P8
  other vias: 54.08,29.74
J_B  (via drill 0.35)
  Top 0.305: U$18.P3 U$18.P1 52.18,29.68 v51.56,29.06
  Bottom 0.305: U$9.P10 51.53,29.09 v51.56,29.06
J_BRT  (via drill 0.35)
  Top 0.305: U$25.P1 38.46,61.53 | 38.46,61.53 U$25.P2 | 38.46,61.53 42.46,57.52 v42.46,52.96 | v42.46,36.36 42.46,32.31 41.5,32.31 39.34,30.15 39.34,28.42 40.32,27.45 43.42,27.45 44.52,26.36 44.52,25.4 43.89,24.77 v43.89,24.51
  Bottom 0.305: v42.46,52.96 42.46,52.51 42.66,52.31 42.66,36.56 v42.46,36.36 | v43.89,24.51 43.89,23.36 U$9.P15
J_DWN  (via drill 0.35)
  Top 0.305: U$13.P3 v14.41,37.6 U$13.P1
  Bottom 0.305: v14.41,37.6 16.97,35.05 16.97,24.33 U$9.P37
J_LFT  (via drill 0.35)
  Top 0.305: U$11.P1 U$11.P3 14.29,44.29 14.29,43.47 14.5,43.26 15.82,43.26 17.69,41.39 18.7,41.39 18.71,41.4 21.01,41.4 21.72,40.69 21.72,34.37 33.46,22.63 39.13,22.63 39.84,23.34 39.85,23.34 41,24.49 42.91,24.49 43.93,23.47 53.94,23.47 U$9.P7
  other vias: 54.08,23.34
J_LSH  (via drill 0.35)
  Top 0.305: v17.35,45.3 17.35,44.45 v18.28,43.51
  Bottom 0.305: U$26.1 8.74,67.91 9.35,67.91 17.35,59.91 17.35,54.8 18.25,53.89 18.25,50.9 17.35,49.99 v17.35,45.3 | U$9.P32 23.59,38.2 v18.28,43.51
J_RGT  (via drill 0.35)
  Top 0.305: U$12.P1 24.18,44.24 25.08,43.34 25.66,43.34 26.56,44.24 U$12.P3 26.73,44.14 26.73,43.32 26.93,43.11 37.83,43.11 46.88,34.05 46.88,33.38 46.79,33.38 46.47,33.05 46.18,33.05 44.5,31.37 44.5,30.15 46.88,27.77 46.88,26.75 v48.95,24.69
  Bottom 0.305: v48.95,24.69 48.99,24.64 U$9.P11
J_RSH  (via drill 0.35)
  Top 0.305: U$9.P16 46.37,27.28 46.37,26.26 48.65,23.98 49.24,23.98 49.65,24.39 49.65,39.58 47.23,42 47.23,43.82 48.45,45.04 48.45,47.6 49.16,48.3 49.16,48.89 48.74,49.31 48.65,49.31 v48.45,49.51
  Bottom 0.305: U$28.1 70.37,69.03 69.17,67.83 68.03,67.83 68,67.86 66.14,67.86 65.23,68.77 56.56,68.77 55.37,67.59 55.37,66 53.59,64.22 51.07,64.22 50.57,63.71 49.27,63.71 48.25,62.69 48.25,50.47 48.45,50.27 v48.45,49.51
  other vias: 43.91,29.74
J_SEL  (via drill 0.35)
  Top 0.305: U$21.P2 29.57,7.68 | 29.57,7.68 U$21.P1 | 29.57,7.68 29.47,7.78 29.47,8.88 29.05,9.29 27.84,9.29 26.14,11 26.14,14.14 27.16,15.16 27.16,15.75 26.74,16.16 26.46,16.16 25.73,16.89 25.73,22.94 v26.14,23.34
J_ST  (via drill 0.35)
  Top 0.305: v43.16,7.68 U$22.P1 U$22.P2
  Bottom 0.305: U$9.P31 25.14,21.79 25.14,21.39 29.86,16.67 36.26,16.67 37.32,15.61 37.32,13.52 v43.16,7.68
J_UP  (via drill 0.35)
  Top 0.305: U$10.P1 U$10.P3 20.41,47.65 19.31,46.55 19.31,43.54 18.58,42.81 18.39,42.81 v18.19,42.61
  Bottom 0.305: v18.19,42.61 18.3,42.49 18.59,42.49 23.09,37.99 23.09,34.71 20.06,31.68 20.06,31.29 U$9.P36
J_X  (via drill 0.35)
  Top 0.305: U$15.P3 U$15.P1 61.26,46.8 61.26,45.98 61.06,45.77 60.23,45.77 50.16,35.7 50.16,25.65 v50.36,25.45 | U$9.P38 25.64,29.74 34.39,20.98 v49.07,20.98
  Bottom 0.305: v50.36,25.45 49.99,25.07 49.99,21.39 49.78,21.18 49.27,21.18 v49.07,20.98
  other vias: 15.97,29.74
J_Y  (via drill 0.35)
  Top 0.305: U$16.P3 U$16.P1 48.55,41.4 50.16,39.79 50.16,37.1 v50.36,36.9
  Bottom 0.305: U$9.P13 46.45,23.72 48,25.27 48,25.29 50.54,27.82 50.54,36.72 v50.36,36.9
KEEPALIVE
  Bottom 0.305: R10.2 63.08,8.53 64.13,9.59 64.85,9.59 U$40.3 65.82,10.56 68.78,10.56 69.17,10.95 69.17,18.11 68.44,18.84 65.94,18.84 62.69,22.09 62.69,25.29 62.48,25.49 60.91,25.49 60.7,25.29 60.7,24.89 U$9.P3
LBO
  Bottom 0.254: 22.64,47.65 22.64,51.25 24.25,52.86 24.86,52.86 25.3,53.3 25.3,54.73 25.49,54.92 26.6,54.92 26.87,55.2 26.87,56.83 27.68,57.63 U1.12
  Bottom 0.305: 22.64,47.65 22.64,46.8 23.44,46 23.97,46 T1.B
MISO  (via drill 0.35)
  Top 0.305: v36.3,23.34 36.4,23.44 37.94,23.44 40,25.5 42.29,25.5 v43.13,26.34
  Bottom 0.305: BCM21,GPIO9.1 52.54,68.06 53.68,68.06 54.36,67.38 54.36,66.42 53.17,65.24 50.65,65.24 50.15,64.73 48.85,64.73 47.23,63.11 47.23,34.31 46.88,33.97 46.88,33.47 46.47,33.05 45.97,33.05 45.41,32.5 45.41,27.48 44.67,26.74 43.53,26.74 v43.13,26.34
MOSI  (via drill 0.35)
  Top 0.305: v43.81,25.69 43.11,24.99 40.77,24.99 39.12,23.34 U$9.P19
  Bottom 0.305: BVM19,GPIO10.1 53.2,69.25 54.86,67.59 54.86,66.21 53.38,64.73 50.86,64.73 50.35,64.22 49.06,64.22 47.74,62.9 47.74,33.6 47.45,33.31 47.45,27.79 45.89,26.23 44.29,26.23 43.81,25.75 v43.81,25.69
  other vias: 38.84,23.34
N$1
  Bottom 0.203: U1.3 29.01,62.52 U1.4
  Bottom 0.305: L1.P$2 7.12,37.43 7.12,38.23 12.77,43.89 16.94,43.89 17.78,44.73 18.96,44.73 19.57,44.12 20.4,44.12 20.51,44.01 22.91,44.01 23.36,44.46 23.36,45.37 21.84,46.89 21.84,61.04 22.05,61.26 24.05,61.26 24.06,61.27 25.38,61.27 25.64,61.53 25.64,62.85 26.19,63.4 28.55,63.4 28.86,63.09 28.86,62.67 29.01,62.52
N$2  (via drill 0.35)
  Top 0.305: LBO.A 72.09,60.14 R20.1
  other vias: 68.52,60.14
N$3
  Bottom 0.203: R2.2 34.3,58.26 R1.1 34.07,58.17 33.07,57.17 31.72,57.17 30.57,58.32 U1.9
N$4  (via drill 0.35)
  Top 0.305: ON.A 72.81,62.26 R5.2
  other vias: 68.53,62.26
N$5
  Bottom 0.203: U1.14 26.38,59.92 26,59.92 25.72,59.64 25.72,59.26 24.74,58.28 | 24.74,58.28 R4.2 | R3.1 24.66,58.28 24.74,58.28
N$6  (via drill 0.35)
  Top 0.305: R20.2 66.52,53.77 64.49,51.74 38.09,51.74 37.11,52.72 35.52,52.72 33.52,50.72 29.14,50.72 28.48,51.38 27.89,51.38 25.77,49.26 25.77,44.45 T1.C
  other vias: 66.52,60.14 25.37,44.05
N$7
  Bottom 0.203: U2.P$2 29.59,52.8 29.59,53.24 29.32,53.51 29.32,55.23 | 29.32,55.23 29.14,55.41 | 29.14,55.41 27.49,55.41 27.31,55.23 27.31,55.02 R7.1 | 29.39,55.57 R6.1 | 29.39,55.57 29.23,55.41 29.14,55.41 | 29.39,55.57 29.32,55.5 29.32,55.23
N$8  (via drill 0.35)
  Top 0.305: DONE.C 67.67,50.72 37.1,50.72 R14.2
  other vias: 35.81,52.01
N$9
  Bottom 0.279: U2.P$7 33.08,51.28 33.18,51.38
  Bottom 0.305: 33.18,51.38 R14.1
N$10
  Bottom 0.279: U2.P$5 31.15,52.81 31.27,52.93
  Bottom 0.305: 31.27,52.93 THERM.2
N$11
  Bottom 0.254: U2.P$8 32.33,50.78
  Bottom 0.305: 32.33,50.78 33.22,50.78 R8.1
N$12  (via drill 0.35)
  Top 0.305: CHRG/LBO.C 72.49,56.94 72.49,56.26 67.46,51.23 37.59,51.23 v37.4,51.43
  Bottom 0.305: 36.69,49.78 R8.2 36.46,50.49 v37.4,51.43
N$13
  Bottom 0.279: U2.P$12 30.65,48.67
  Bottom 0.305: 30.65,48.67 30.65,47.5 R17.2
N$14
  Top 0.305: 51.03,8.38 50.09,8.38 50.09,7.29 50.9,7.29 50.9,7.64
N$15
  Top 0.305: 50.9,7.75 50.6,7.82
N$16
  Bottom 0.254: 29.65,47.94 29.83,48.12 29.93,48.12 30.15,48.34 U2.P$13
  Bottom 0.305: R16.2 29.12,47.41 29.12,47.73 29.33,47.94 29.65,47.94 29.81,48.09
N$17
  Top 0.305: 51.97,8.38 51.97,7.87 | 51.97,7.87 51.97,7.29 | 51.97,7.87 52.88,7.87
N$18
  Bottom 0.254: C10.1 16.14,47.03 R12.2
  Bottom 0.305: C11.1 14.26,49.56 R15.2 15.16,48.27 16.19,47.24 C10.1
N$19
  Top 0.305: 52.91,8.38 52.91,7.26
N$21
  Bottom 0.305: U$31.P$1 67.92,16.54 68.3,16.16 68.3,14.82 67.93,14.44 U$40.1
N$35
  Bottom 0.305: U$29.P$3 13.2,52.4 C11.2
N$37
  Bottom 0.305: 11.5,56.5 12.1,57.1 | 11.5,56.5 3.92,48.92 3.92,28.01 15.76,16.16 36.05,16.16 36.81,15.4 36.81,13.61 35.75,12.54 C12.1 | U$29.P$2 11.5,56.7 11.5,56.5
N$38  (via drill 0.35)
  Top 0.305: v28.76,8.59 | v28.76,8.59 27.88,8.59 22.52,3.23 18.61,3.23 18.2,3.64 18.2,4.23 18.92,4.96 18.92,12 v14.76,16.16
  Bottom 0.305: U$29.P$1 10.99,58.19 10.99,56.71 3.41,49.13 3.41,27.8 14.76,16.45 v14.76,16.16 | v28.76,8.59 28.46,8.29 C13.1
N$39
  Bottom 0.254: R19.2 30.35,8.27 C13.2
N$40
  Bottom 0.305: R18.2 C12.2
N$41
  Bottom 0.254: U4.3 29.55,12.6 R18.1
N$42
  Bottom 0.305: U4.4 27.37,11.38 R19.1
N$45
  Bottom 0.254: U4.1 29.15,13.9 R21.1
N$47  (via drill 0.35)
  Top 0.305: v23.36,11.15 23.37,11.15 v24.85,12.62
  Bottom 0.305: FB1.1 23.36,4.21 v23.36,11.15 | v24.85,12.62 24.85,12.81 23.86,13.8 23.82,13.8 23.82,13.81 23.07,13.81 U4.8
N$48
  Bottom 0.254: U4.5 22.9,12.02 22.11,12.02 21.36,12.78 FB2.1
PWM0  (via drill 0.35)
  Top 0.305: v19.89,42.91 19.49,42.91 18.48,41.9 17.9,41.9 15.51,44.29 15.51,46.56 14.23,47.83 13.13,47.83 v12.22,46.91 | v48.15,28.42 47.39,29.19 47.39,34.26 38.04,43.62 29.57,43.62 v29.37,43.82
  Bottom 0.305: v29.37,43.82 29.28,43.82 28.46,42.99 19.98,42.99 v19.89,42.91 | R12.1 14.14,45.09 13.16,45.09 13.16,45.97 v12.22,46.91 | v48.15,28.42 48.15,28.9 U$9.P12
RT_CS  (via drill 0.35)
  Top 0.305: v33.04,33.65 33.04,31.56 U$9.P26
  Bottom 0.305: BCM26,GPIO7.1 44.83,69.4 43.68,70.56 42.72,70.56 41.54,69.37 41.54,66.21 44.18,63.56 44.18,61.59 44.18,35.65 41.99,33.45 33.24,33.45 v33.04,33.65
  other vias: 31.21,29.74
RT_INT  (via drill 0.35)
  Top 0.305: v46.17,33.76 42.15,29.74 U$9.P18
  Bottom 0.305: BCM18,GPIO24.1 52.04,65.74 50.4,65.74 49.89,65.24 48.64,65.24 46.72,63.32 46.72,34.59 46.17,34.04 v46.17,33.76
  other vias: 41.38,29.74
SCLK  (via drill 0.35)
  Top 0.305: v33.82,34.16 33.82,30.8 33.05,30.03 33.05,29.45 33.76,28.74 v33.76,23.34
  Bottom 0.305: BCM23,GPIO11.1 46.04,70.56 44.4,70.56 43.89,71.06 42.51,71.06 41.03,69.58 41.03,66.9 41.03,66 43.68,63.35 43.68,59.89 43.68,35.86 43.32,35.5 41.78,33.96 34.3,33.96 34.1,34.16 v33.82,34.16
SHUTDOWN  (via drill 0.35)
  Top 0.305: v13.44,29.74 14.26,29.74 16.13,27.87 25.83,27.87 v26.31,27.38
  Bottom 0.305: U$31.P$4 64.07,18.95 42.54,18.95 40.87,20.62 40.87,21.16 40.84,21.18 38.05,21.18 37.29,21.95 37.29,25.29 37.08,25.49 34.75,25.49 34.75,21.39 34.54,21.18 27.89,21.18 27.68,21.39 27.68,26.01 v26.31,27.38
TFT_CS  (via drill 0.35)
  Top 0.305: v34.59,34.67 34.59,30.58 v33.76,29.74
  Bottom 0.305: BCM24,GPIO8.1 48.83,69.4 47.68,70.56 46.76,70.56 46.26,71.06 44.61,71.06 44.1,71.57 42.3,71.57 40.52,69.79 40.52,65.79 43.17,63.14 43.17,61.59 43.17,58.91 43.17,36.07 41.7,34.6 34.66,34.6 v34.59,34.67
TFT_DC
  Bottom 0.305: BCM22,GPIO25.1 48.87,66.9 45.71,63.74 45.71,35.02 42.62,31.93 38.09,31.93 36.3,30.14 U$9.P22 36.31,29.75
VBAT  (via drill 0.35)
  Top 0.305: R1.2 28.72,58.17 28.65,58.24 28.07,58.24 27.65,57.82 27.65,57.11 29.49,55.27 30.68,55.27 31.09,54.85 31.09,54.27 30.68,53.85 29.04,53.85 28.57,54.33 28.52,54.33 28.36,54.48 v28.12,54.48
  Bottom 0.203: 29.14,52.76 U2.P$1 | 26.74,51.78 C4.1 | R1.2 31.12,59.44 U1.8
  Bottom 0.254: 26.57,49.53 C1.1
  Bottom 0.279: 29.03,52.63 U2.P$1
  Bottom 0.305: C4.1 26.57,51.61 26.57,49.53 | 29.14,52.76 28.32,53.58 R13.1 28.19,54.55 v28.12,54.48 | C1.1 26.57,46.7 T1.E 26.12,46.45 24.78,45.11 24.73,45.11 23.12,43.5 20.3,43.5 20.19,43.62 19.18,43.62 18.58,44.22 17.99,44.22 17.15,43.38 12.98,43.38 8.47,38.87 L1.P$1 | 26.74,51.78 U2.P$20 28.54,52.14 28.54,52.18 28.75,52.38 28.79,52.38 29.03,52.63
  other vias: 32.39,58.17
VBUS  (via drill 0.35)
  Top 0.305: v27.86,71.54 27.86,62.43 | 27.86,62.43 27.48,62.05 27.45,62.05 27.02,61.62 27.02,58.4 27.02,57.78 27.02,56.59 29.05,54.56 R6.2 | v28.18,50.67 28.75,50.11 28.75,48.52 29.62,47.65 v31.75,47.65 | CHRG/LBO.A DONE.A | v41.95,48.51 48.36,48.51 v48.45,48.6 | 27.86,62.43 34.66,62.43 48.92,62.43 v48.96,62.4
  Bottom 0.203: 30.65,52.78 U2.P$4 | 30.65,53.75 30.65,52.78 | U2.P$3 30.61,52.74 30.65,52.78
  Bottom 0.254: CN4.VBUS 27.97,71.64 v27.86,71.54 | v28.18,50.67 U2.P$19 | 32.62,50.28 32.63,50.27
  Bottom 0.279: U2.P$9 32.62,50.28
  Bottom 0.305: U2.P$18 v28.18,50.67 U2.P$17 | 32.63,50.27 32.84,50.07 32.84,49.49 31.75,48.41 v31.75,47.65 31.75,47.45 C8.1 | U2.P$4 30.65,53.75 30.65,54.29 R6.2 30.15,54.33 U2.P$3 | C8.1 | C8.1 33.77,48.49 37.15,48.49 37.18,48.51 v41.95,48.51 | 48.76,62.28 48.76,62.48 49.48,63.2 50.78,63.2 51.28,63.71 53.8,63.71 55.88,65.79 55.88,67.38 56.75,68.25 64.95,68.25 66.12,67.08 66.12,65.98 66.9,65.2 67.34,65.2 69.43,63.1 69.43,63.02 CHRG/LBO.A | 48.76,62.28 48.76,50.68 49.16,50.28 49.16,49.21 48.74,48.8 48.65,48.8 v48.45,48.6 | v48.96,62.4 48.84,62.28 48.76,62.28
  other vias: 74.75,57.7 30.38,54.56
VLIPO  (via drill 0.35)
  Top 0.305: v73.36,50.22 30.85,50.22 v29.45,48.81
  Bottom 0.279: U2.P$16 28.29,49.67
  Bottom 0.305: C7.1 73.36,46.03 v73.36,50.22 B1.2 | 28.29,49.67 28.54,49.42 28.54,49.38 28.75,49.17 28.79,49.17 U2.P$15 U2.P$14 v29.45,48.81

### Text on the board
tPlace: V1.2
tNames: 28 | 26 | 23 | 24 | 21 | 19 | 6 | 27 | 2 | 22 | 1 | 18 | G | R | O | B | SPEAKER | CMP / VIDEO | HDPN
bNames: USB / CHRG | 28 | 26 | 23 | 24 | 21 | 19 | 6 | 27 | 2 | 22 | 1 | 18
tValues: + | + | + | +
tDocu: PiBoy SP by Grant Haack / https://www.granthaack.com/piboy-sp / / PCB Layout and Design is licensed under / Creative Commons / Attribution-NonCommercial 4.0 / International (CC BY-NC 4.0)